# Altium schematic sheet MCU.SchDoc
size 420 x 297 mm; Address1: Address1; Address2: Address2; Address3: Address3; Address4: Address4; SheetNumber: 4; SheetTotal: 6
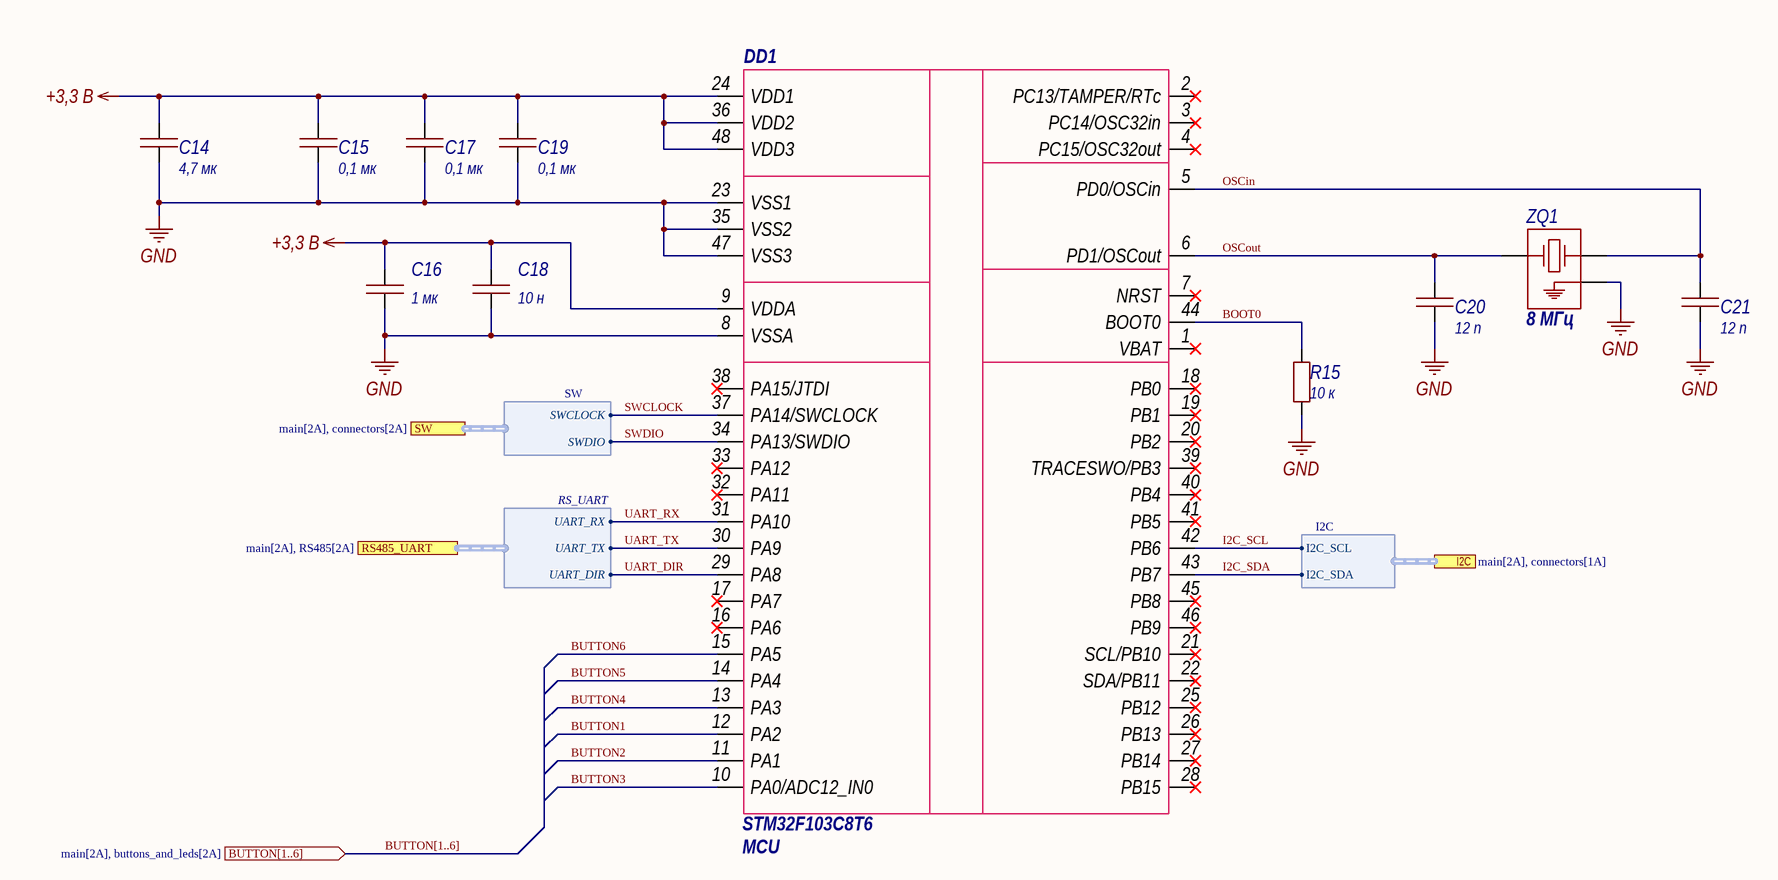
[diagram p0: MCU.SchDoc]

## Parts
C14  value 4,7 мк  [1206C]  (hidden comment: Capacitor)
C15  value 0,1 мк  [0603C]  (hidden comment: Capacitor)
C16  value 1 мк  [0603C]  (hidden comment: Capacitor)
C17  value 0,1 мк  [0603C]  (hidden comment: Capacitor)
C18  value 10 н  [0603C]  (hidden comment: Capacitor)
C19  value 0,1 мк  [0603C]  (hidden comment: Capacitor)
C20  value 12 п  [0603C]  (hidden comment: Capacitor)
C21  value 12 п  [0603C]  (hidden comment: Capacitor)
DD1  STM32F103C8T6  Value1: MCU  [LQFP48]
R15  value 10 к  [0603R]  (hidden comment: Resistor)
ZQ1  value 8 МГц  [QSMD3.2x2.5]  (hidden comment: XTAL_GND)

## Ports
BUTTON[1..6] (in, see main[2A], buttons_and_leds[2A]), I2C (harness I2C, see main[2A], connectors[1A]), RS485_UART (harness RS_UART, see main[2A], RS485[2A]), SW (harness SW, see main[2A], connectors[2A])

## Harnesses
SW: SWCLOCK, SWDIO
I2C: I2C_SDA, I2C_SCL
RS_UART: UART_RX, UART_TX, UART_DIR

## Nets
+3,3 В: C14.2 C15.2 C16.2 C17.2 C18.2 C19.2 DD1.9(VDDA) DD1.24(VDD1) DD1.36(VDD2) DD1.48(VDD3)
GND: C14.1 C15.1 C16.1 C17.1 C18.1 C19.1 C20.1 C21.1 DD1.8(VSSA) DD1.23(VSS1) DD1.35(VSS2) DD1.47(VSS3) R15.1 ZQ1.3
BOOT0: DD1.44(BOOT0) R15.2
BUTTON1: DD1.12(PA2)
BUTTON2: DD1.11(PA1)
BUTTON3: DD1.10(PA0/ADC12_IN0)
BUTTON4: DD1.13(PA3)
BUTTON5: DD1.14(PA4)
BUTTON6: DD1.15(PA5)
I2C_SCL: DD1.42(PB6) ; port I2C.I2C_SCL
I2C_SDA: DD1.43(PB7) ; port I2C.I2C_SDA
OSCin: C21.2 DD1.5(PD0/OSCin) ZQ1.2
OSCout: C20.2 DD1.6(PD1/OSCout) ZQ1.1
SWCLOCK: DD1.37(PA14/SWCLOCK) ; port SW.SWCLOCK
SWDIO: DD1.34(PA13/SWDIO) ; port SW.SWDIO
UART_DIR: DD1.29(PA8) ; port RS485_UART.UART_DIR
UART_RX: DD1.31(PA10) ; port RS485_UART.UART_RX
UART_TX: DD1.30(PA9) ; port RS485_UART.UART_TX

Not connected (* = marked no-connect by the designer): DD1 1(VBAT)* 2(PC13/TAMPER/RTc)* 3(PC14/OSC32in)* 4(PC15/OSC32out)* 7(NRST)* 16(PA6)* 17(PA7)* 18(PB0)* 19(PB1)* 20(PB2)* 21(SCL/PB10)* 22(SDA/PB11)* 25(PB12)* 26(PB13)* 27(PB14)* 28(PB15)* 32(PA11)* 33(PA12)* 38(PA15/JTDI)* 39(TRACESWO/PB3)* 40(PB4)* 41(PB5)* 45(PB8)* 46(PB9)*

## Buses and harness runs
bus BUTTON[1..6] = port BUTTON[1..6]

## Notes on the sheet
- Перв. примен.
- Справ. №
- Подп. и дата
- Инв. № дубл.
- Взам. инв. №
- Разраб.
- Изм.
- Лист
- № докум.
- Подп.
- Дата
- Лит.
- Масса
- Масштаб
- Пров.
- Т.контр.
- Схема электрическая принципиальная
- Листов
- Инв. № подл.
- Утв.
- Н.контр.
- Копировал
- Формат А3

## Library data of the parts
C14 = Capacitor_4,7u_10_50V_X7R_1206C: Конденсатор 1206C ёмкостью 4,7 мк 10%, 50 В, X7R; Library Path2: Schematic\Capacitor.SchLib; Voltage (V): 50; Capacity (nF): 4700; Part Number: Capacitor_4,7u_10_50V_X7R_1206C; Tolerance: 10%; Dielectric: X7R
C15 C17 C19 = Capacitor_0,1u_10_50V_X7R_0603C: Конденсатор 0603C ёмкостью 0,1 мк 10%, 50 В, X7R; Library Path2: Schematic\Capacitor.SchLib; Voltage (V): 50; Capacity (nF): 100; Part Number: Capacitor_0,1u_10_50V_X7R_0603C; Tolerance: 10%; Dielectric: X7R
C16 = Capacitor_1u_10_50V_X7R_0603C: Конденсатор 0603C ёмкостью 1 мк 10%, 50 В, X7R; Library Path2: Schematic\Capacitor.SchLib; Voltage (V): 50; Capacity (nF): 1000; Part Number: Capacitor_1u_10_50V_X7R_0603C; Tolerance: 10%; Dielectric: X7R
C18 = Capacitor_10n_10_50V_X7R_0603C: Конденсатор 0603C ёмкостью 10 н 10%, 50 В, X7R; Library Path2: Schematic\Capacitor.SchLib; Voltage (V): 50; Capacity (nF): 10; Part Number: Capacitor_10n_10_50V_X7R_0603C; Tolerance: 10%; Dielectric: X7R
C20 C21 = 0,1 мк: Конденсатор 12п; Part Number: Capacitor
DD1 = STM32F103C8T6: Микроконтроллер; Manufacturer: ST Microelectronics; Rate: -0,3...4,0В; Shop: магазин с самой дешевой ценой; Notice: 48 пиновая версия STM32F103; Datasheet: http://www.st.com/content/ccc/resource/technical/document/datasheet/33/d4/6f/1d/df/0b/4c/6d/CD00161566.pdf/files/CD00161566.pdf/jcr:content/translations/en.CD00161566.pdf; Case: корпус; Part Number: STM32F103C8T6
R15 = Resistor_10k_1_0603: Резистор номиналом 10 кОм 1%; Power: *; Part Number: Resistor_10k_1_0603; Tolerance: 1%
ZQ1 = XTAL_GND: Кварцевый резонатор с входом земли; Part Number: XTAL_GND